# EasyEDA Pro project uven2-mk3-cc-driver-80x.eprj, board cc-driver
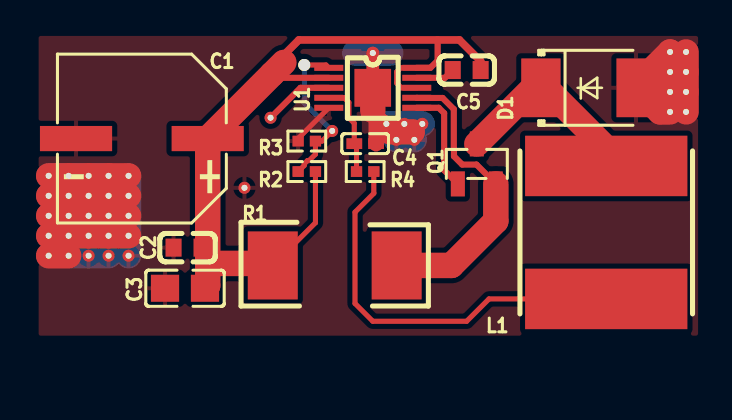
[diagram p4: board, top side]
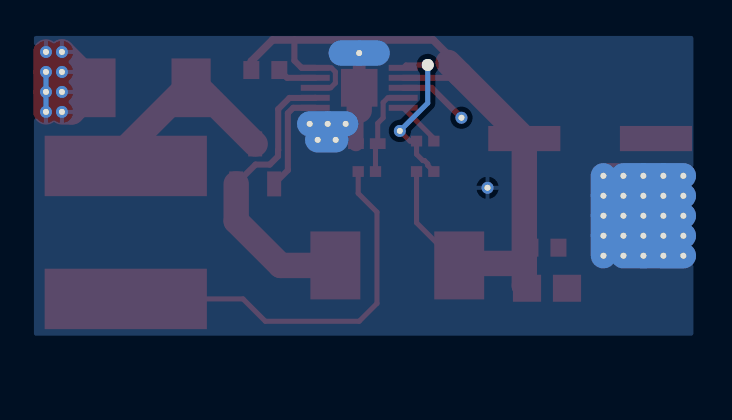
[diagram p5: board, bottom side, seen from below]

No outline. copper layers: Top Layer, Bottom Layer. Coordinates in mm from the lowest, leftmost part position.
Stack: Top Layer 0.035mm / Dielectric1 1.51mm FR4 er 4.5 / Bottom Layer 0.035mm

## Design rules (mm)
template: JLCPCB Capability(Two Layers Board)
spacing copperThickness1oz (default): track to track 0.102, other pairs 0.152 to 0.3
spacing copperThickness2oz: track to track 0.203, other pairs 0.152 to 0.3
track width copperThickness1oz (default): min 0.127, default 0.254, max 2.54
track width copperThickness2oz: min 0.203, default 0.254, max 2.54
differential pair differentialPair (default): width min 0.127, default 0.254, max 2.54; gap min 0.152, default 0.152
via viaSize (default): diameter min 0.5, default 0.61, max 10; hole min 0.3, default 0.305, max 6.3

## Placement (name value [footprint] x y rotation side)
C1  470uF  [CAP-SMD_BD8.0-L8.3-W8.3-LS9.1-FD]  4.66 7.49 180 top
C2  1uF  [C0603]  6.95 2.03 0 top
C3  10uF  [C0805]  6.82 0 0 top
C4  1nF  [C0402]  15.84 7.24 180 top
C5  1uF  [C0603]  20.92 10.92 0 top
D1  SR34_R2_00001  [SMB_L4.3-W3.6-LS5.4-R-RD]  27.02 10.03 0 top
L1  15uH  [IND-SMD_L8.0-W8.0-HPC8040NF-150M]  27.91 2.79 90 top
NOREF  -  [Pad_e340]  3 4.63 0 top
NOREF#2  -  [Pad_e2237]  11.11 8.53 0 top
NOREF#3  -  [Pad_e350]  3 2.63 0 top
NOREF#4  -  [Pad_e1001]  16.22 11.77 0 top
NOREF#5  -  [Pad_e299]  0 5.63 0 top
NOREF#6  -  [Pad_e241]  14.19 7.87 0 top
NOREF#7  -  [Pad_e338]  1 4.63 0 top
NOREF#8  -  [Pad_e353]  1 1.63 0 top
NOREF#9  -  [Pad_e342]  0 3.63 0 top
NOREF#10  -  [Pad_e853]  31.1 9.83 0 top
NOREF#11  -  [Pad_e355]  3 1.63 0 top
NOREF#12  -  [Pad_e352]  0 1.63 0 top
NOREF#13  -  [Pad_e856]  31.1 10.83 0 top
NOREF#14  -  [Pad_e339]  2 4.63 0 top
NOREF#15  -  [Pad_e609]  16.9 8.23 0 top
NOREF#16  -  [Pad_e335]  3 5.63 0 top
NOREF#17  -  [Pad_e855]  31.1 8.83 0 top
NOREF#18  -  [Pad_e346]  4 3.63 0 top
NOREF#19  -  [Pad_e333]  1 5.63 0 top
NOREF#20  -  [Pad_e613]  17.4 7.43 0 top
NOREF#21  -  [Pad_e864]  31.9 8.83 0 top
NOREF#22  -  [Pad_e336]  4 5.63 0 top
NOREF#23  -  [Pad_e862]  31.9 9.83 0 top
NOREF#24  -  [Pad_e854]  31.1 11.83 0 top
NOREF#25  -  [Pad_e356]  4 1.63 0 top
NOREF#26  -  [Pad_e612]  18.3 7.43 0 top
NOREF#27  -  [Pad_e351]  4 2.63 0 top
NOREF#28  -  [Pad_e347]  0 2.63 0 top
NOREF#29  -  [Pad_e235]  12.79 11.18 0 top
NOREF#30  -  [Pad_e344]  2 3.63 0 top
NOREF#31  -  [Pad_e611]  18.7 8.23 0 top
NOREF#32  -  [Pad_e345]  3 3.63 0 top
NOREF#33  -  [Pad_e349]  2 2.63 0 top
NOREF#34  -  [Pad_e348]  1 2.63 0 top
NOREF#35  -  [Pad_e334]  2 5.63 0 top
NOREF#36  -  [Pad_e341]  4 4.63 0 top
NOREF#37  -  [Pad_e865]  31.9 10.83 0 top
NOREF#38  -  [Pad_e337]  0 4.63 0 top
NOREF#39  -  [Pad_e343]  1 3.63 0 top
NOREF#40  -  [Pad_e354]  2 1.63 0 top
NOREF#41  -  [Pad_e863]  31.9 11.83 0 top
NOREF#42  -  [Pad_e2157]  9.8 5.03 0 top
NOREF#43  -  [Pad_e610]  17.8 8.23 0 top
Q1  AO3401A  [SOT-23-3_L2.9-W1.3-P1.90-LS2.4-BR]  21.43 6.22 270 top
R1  80mΩ  [RES-SMD_L6.4-W3.2-1]  14.32 1.14 180 top
R2  24kΩ  [R0402]  12.92 5.84 0 top
R3  4.7kΩ  [R0402]  12.92 7.37 0 top
R4  6.2kΩ  [R0402]  15.84 5.84 0 top
U1  LM3409MY/NOPB  [HVSSOP-10_L3.0-W3.0-P0.50-LS4.9-BL-EP]  16.22 10.03 270 top

## Footprints (pads in the part's own frame, mm; a bottom-side part is the same pattern mirrored in y, then rotated)
C0402
  rect 0.79x0.54 smd: 1(-0.545,0) 2(0.545,0)
C0603
  rect 0.8x0.9 smd: 1(-0.7,0) 2(0.7,0)
C0805
  rect 1.41x1.35 smd: 1(-1,0) 2(1,0)
CAP-SMD_BD8.0-L8.3-W8.3-LS9.1-FD
  rect 3.61x1.26 smd: 1(-3.295,0) 2(3.295,0)
HVSSOP-10_L3.0-W3.0-P0.50-LS4.9-BL-EP
  rect 0.3x1.45 smd: 1(-1,-2.201) 2(-0.5,-2.201) 3(0.001,-2.201) 4(0.5,-2.201) 5(1,-2.201) 6(1,2.201) 7(0.5,2.201) 8(0,2.201) 9(-0.5,2.201) 10(-1,2.201)
  rect 1.89x1.83 smd: 11(-0.001,-0.001)
IND-SMD_L8.0-W8.0-HPC8040NF-150M
  rect 3.024x8.12 smd: 1(3.328,0) 2(-3.328,0)
Pad_e235
  round 0.6 hole 0.914x0.3: 1(0,0)
Pad_e241
  round 0.6 hole 0.3: 1(0,0)
Pad_e299
  round 0.6 hole 0.3: 1(0,0)
Pad_e333
  round 0.6 hole 0.3: 1(0,0)
Pad_e334
  round 0.6 hole 0.3: 2(0,0)
Pad_e335
  round 0.6 hole 0.3: 3(0,0)
Pad_e336
  round 0.6 hole 0.3: 12(0,0)
Pad_e337
  round 0.6 hole 0.3: 13(0,0)
Pad_e338
  round 0.6 hole 0.3: 14(0,0)
Pad_e339
  round 0.6 hole 0.3: 15(0,0)
Pad_e340
  round 0.6 hole 0.3: 16(0,0)
Pad_e341
  round 0.6 hole 0.3: 17(0,0)
Pad_e342
  round 0.6 hole 0.3: 18(0,0)
Pad_e343
  round 0.6 hole 0.3: 19(0,0)
Pad_e344
  round 0.6 hole 0.3: 20(0,0)
Pad_e345
  round 0.6 hole 0.3: 21(0,0)
Pad_e346
  round 0.6 hole 0.3: 22(0,0)
Pad_e347
  round 0.6 hole 0.3: 23(0,0)
Pad_e348
  round 0.6 hole 0.3: 24(0,0)
Pad_e349
  round 0.6 hole 0.3: 25(0,0)
Pad_e350
  round 0.6 hole 0.3: 26(0,0)
Pad_e351
  round 0.6 hole 0.3: 27(0,0)
Pad_e352
  round 0.6 hole 0.3: 28(0,0)
Pad_e353
  round 0.6 hole 0.3: 29(0,0)
Pad_e354
  round 0.6 hole 0.3: 30(0,0)
Pad_e355
  round 0.6 hole 0.3: 31(0,0)
Pad_e356
  round 0.6 hole 0.3: 32(0,0)
Pad_e609
  round 0.6 hole 0.3: 12(0,0)
Pad_e610
  round 0.6 hole 0.3: 12(0,0)
Pad_e611
  round 0.6 hole 0.3: 12(0,0)
Pad_e612
  round 0.6 hole 0.3: 12(0,0)
Pad_e613
  round 0.6 hole 0.3: 12(0,0)
Pad_e853
  round 0.6 hole 0.3: 18(0,0)
Pad_e854
  round 0.6 hole 0.3: 1(0,0)
Pad_e855
  round 0.6 hole 0.3: 23(0,0)
Pad_e856
  round 0.6 hole 0.3: 13(0,0)
Pad_e862
  round 0.6 hole 0.3: 18(0,0)
Pad_e863
  round 0.6 hole 0.3: 1(0,0)
Pad_e864
  round 0.6 hole 0.3: 23(0,0)
Pad_e865
  round 0.6 hole 0.3: 13(0,0)
Pad_e1001
  round 0.6 hole 0.3: 12(0,0)
Pad_e2157
  round 0.6 hole 0.3: 1(0,0)
Pad_e2237
  round 0.6 hole 0.3: 1(0,0)
R0402
  rect 0.566x0.54 smd: 1(-0.433,0) 2(0.433,0)
RES-SMD_L6.4-W3.2-1
  rect 2.5x3.4 smd: 1(-3.1,0) 2(3.1,0)
SMB_L4.3-W3.6-LS5.4-R-RD
  rect 1.96x2.94 smd: 1(2.38,0) 2(-2.38,0)
SOT-23-3_L2.9-W1.3-P1.90-LS2.4-BR
  rect 1.25x0.7 smd: 1(1,-0.95) 2(1,0.95) 3(-1,0)

## Nets
VIN: C1.1 C2.2 C3.2 C5.2 R1.2 R2.2 U1.2 U1.8 U1.10
ANODE: L1.2 R4.2
ENABLE: NOREF#2.1 U1.3
LED-DRIVER-RESCUE_GND-LED-DRIVER-RESCUE: C1.2 C2.1 C3.1 C4.1 D1.1 NOREF.16 NOREF#3.26 NOREF#4.12 NOREF#5.1 NOREF#7.14 NOREF#8.29 NOREF#9.18 NOREF#10.18 NOREF#11.31 NOREF#12.28 NOREF#13.13 NOREF#14.15 NOREF#15.12 NOREF#16.3 NOREF#17.23 NOREF#18.22 NOREF#19.1 NOREF#20.12 NOREF#21.23 NOREF#22.12 NOREF#23.18 NOREF#24.1 NOREF#25.32 NOREF#26.12 NOREF#27.27 NOREF#28.23 NOREF#30.20 NOREF#31.12 NOREF#32.21 NOREF#33.25 NOREF#34.24 NOREF#35.2 NOREF#36.17 NOREF#37.13 NOREF#38.13 NOREF#39.19 NOREF#40.30 NOREF#41.1 NOREF#42.1 NOREF#43.12 R3.1 U1.5 U1.11
$1N1417: C5.1 U1.9
$1N1421: NOREF#6.1 NOREF#29.1 R2.1 R3.2 U1.1
$1N1440: Q1.2 R1.1 U1.7
$1N1457: C4.2 R4.1 U1.4
$1N1463: Q1.1 U1.6
$1N1464: D1.2 L1.1 Q1.3

## Routing (per net, layer and track width the routed paths; a pad name or vN(x,y) marks a point on that pad's centre or on a via; arc(x,y) is an arc through that point)
VIN: length 40.6
  Top Layer w0.254: R1.2 13.35,3.28 R2.2 ; U1.8 17.65,10.03 17.42,10.27 17.42,10.83 17.62,11.03 U1.10
  Top Layer w0.305: U1.10 19.11,11.03 19.47,11.39 19.47,12.43 ; 14.02,10.53 11.36,10.53 11.18,10.71
  Top Layer w0.381: C5.2 21.62,11.36 20.56,12.43 12.52,12.43 11.9,11.81
  Top Layer w1.27: 7.96,1.24 7.96,0.14 C3.2 ; 7.96,1.24 11.12,1.24 R1.2 ; 7.96,1.24 C1.1 11.77,11.3
ANODE: length 20.4
  Top Layer w0.254: R4.2 16.27,4.75 15.33,3.81 15.33,-0.76 16.22,-1.65 20.92,-1.65 22.04,-0.53 L1.2
ENABLE: length 3.5
  Top Layer w0.305: 11.1,8.53 12.6,10.03 14.02,10.03
LED-DRIVER-RESCUE_GND-LED-DRIVER-RESCUE: length 65.8
  Top Layer w0.254: NOREF#8.29 NOREF#34.24 NOREF#39.19 ; 18.2,7.83 18.3,7.73 NOREF#26.12 ; R3.1 12.49,7.5 14.02,9.03
  Top Layer w0.635: NOREF#4.12 16.22,10.55 16.1,10.43 ; 16.39,8.74 NOREF#15.12
  Top Layer w0.762: C4.1 16.39,8.74 16.22,8.91
  Top Layer w1.27: NOREF#27.27 NOREF#3.26 NOREF#33.25 NOREF#34.24 NOREF#28.23 ; NOREF#12.28 NOREF#8.29 ; NOREF#5.1 NOREF#19.1 NOREF#35.2 NOREF#16.3 NOREF#22.12 ; NOREF#18.22 NOREF#32.21 NOREF#30.20 NOREF#39.19 NOREF#9.18 ; 17.1,7.83 18.2,7.83 ; NOREF#17.23 30.6,8.83 D1.1 ; D1.1 29.55,10.19 29.55,10.28 NOREF#24.1 NOREF#13.13 ; D1.1 30.9,10.03 NOREF#10.18 ; NOREF#36.17 NOREF.16 NOREF#14.15 NOREF#7.14 NOREF#38.13 ; NOREF#21.23 NOREF#23.18 NOREF#37.13 NOREF#41.1 ; 16.22,8.91 U1.11
  Bottom Layer w0.254: NOREF#37.13 NOREF#23.18 NOREF#21.23 ; NOREF#5.1 NOREF#38.13 ; NOREF#14.15 NOREF#30.20
  Bottom Layer w1.27: 17.12,11.77 NOREF#4.12 15.32,11.77 ; NOREF#32.21 NOREF#30.20 NOREF#39.19 NOREF#9.18 ; NOREF#5.1 NOREF#19.1 NOREF#35.2 NOREF#16.3 ; NOREF#38.13 NOREF#7.14 NOREF#14.15 NOREF.16 ; NOREF#12.28 NOREF#8.29 NOREF#40.30 NOREF#11.31 ; NOREF#26.12 NOREF#20.12 ; NOREF#31.12 NOREF#43.12 NOREF#15.12 ; NOREF#3.26 NOREF#33.25 NOREF#34.24 NOREF#28.23 ; NOREF#22.12 NOREF#36.17 NOREF#18.22 NOREF#27.27 NOREF#25.32
$1N1417: length 2
  Top Layer w0.305: U1.9 19.83,10.53 C5.1
$1N1421: length 8.1
  Top Layer w0.254: NOREF#6.1 13.68,7.37 R3.2 13.35,6.71 13.04,6.39 12.95,6.39 12.79,6.23 12.79,6.15 R2.1 ; NOREF#29.1 13.88,11.18 14.02,11.03
  Bottom Layer w0.254: NOREF#29.1 12.79,9.27 NOREF#6.1
$1N1440: length 14.9
  Top Layer w0.305: U1.7 18.43,9.53 19.71,9.53 20.28,8.96 20.28,6.92 20.29,6.91 20.29,6.6 20.7,6.19 21.41,6.19 Q1.2
  Top Layer w1.27: R1.1 20.16,1.14 22.38,3.36 Q1.2
$1N1457: length 4.7
  Top Layer w0.254: R4.1 15.41,7.13 C4.2 15.3,8.26 15.03,8.53 15.03,9.3 14.79,9.53 14.02,9.53
$1N1463: length 5.3
  Top Layer w0.305: U1.6 19.52,9.03 19.79,8.76 19.79,5.91 Q1.1
$1N1464: length 10
  Top Layer w1.27: 28.67,6.25 24.88,10.03 D1.2 24.24,10.03 Q1.3

## Copper pours and planes (outline as drawn; the poured copper is in the pictures)
LED-DRIVER-RESCUE_GND-LED-DRIVER-RESCUE on Top Layer: -0.5,12.63 32.5,12.63 32.5,-2.37 -0.5,-2.37
LED-DRIVER-RESCUE_GND-LED-DRIVER-RESCUE on Bottom Layer: -0.5,12.63 32.5,12.63 32.5,-2.37 -0.5,-2.37
